# Altium schematic sheet main.SchDoc
size A3; SheetNumber: 1; SheetTotal: 3
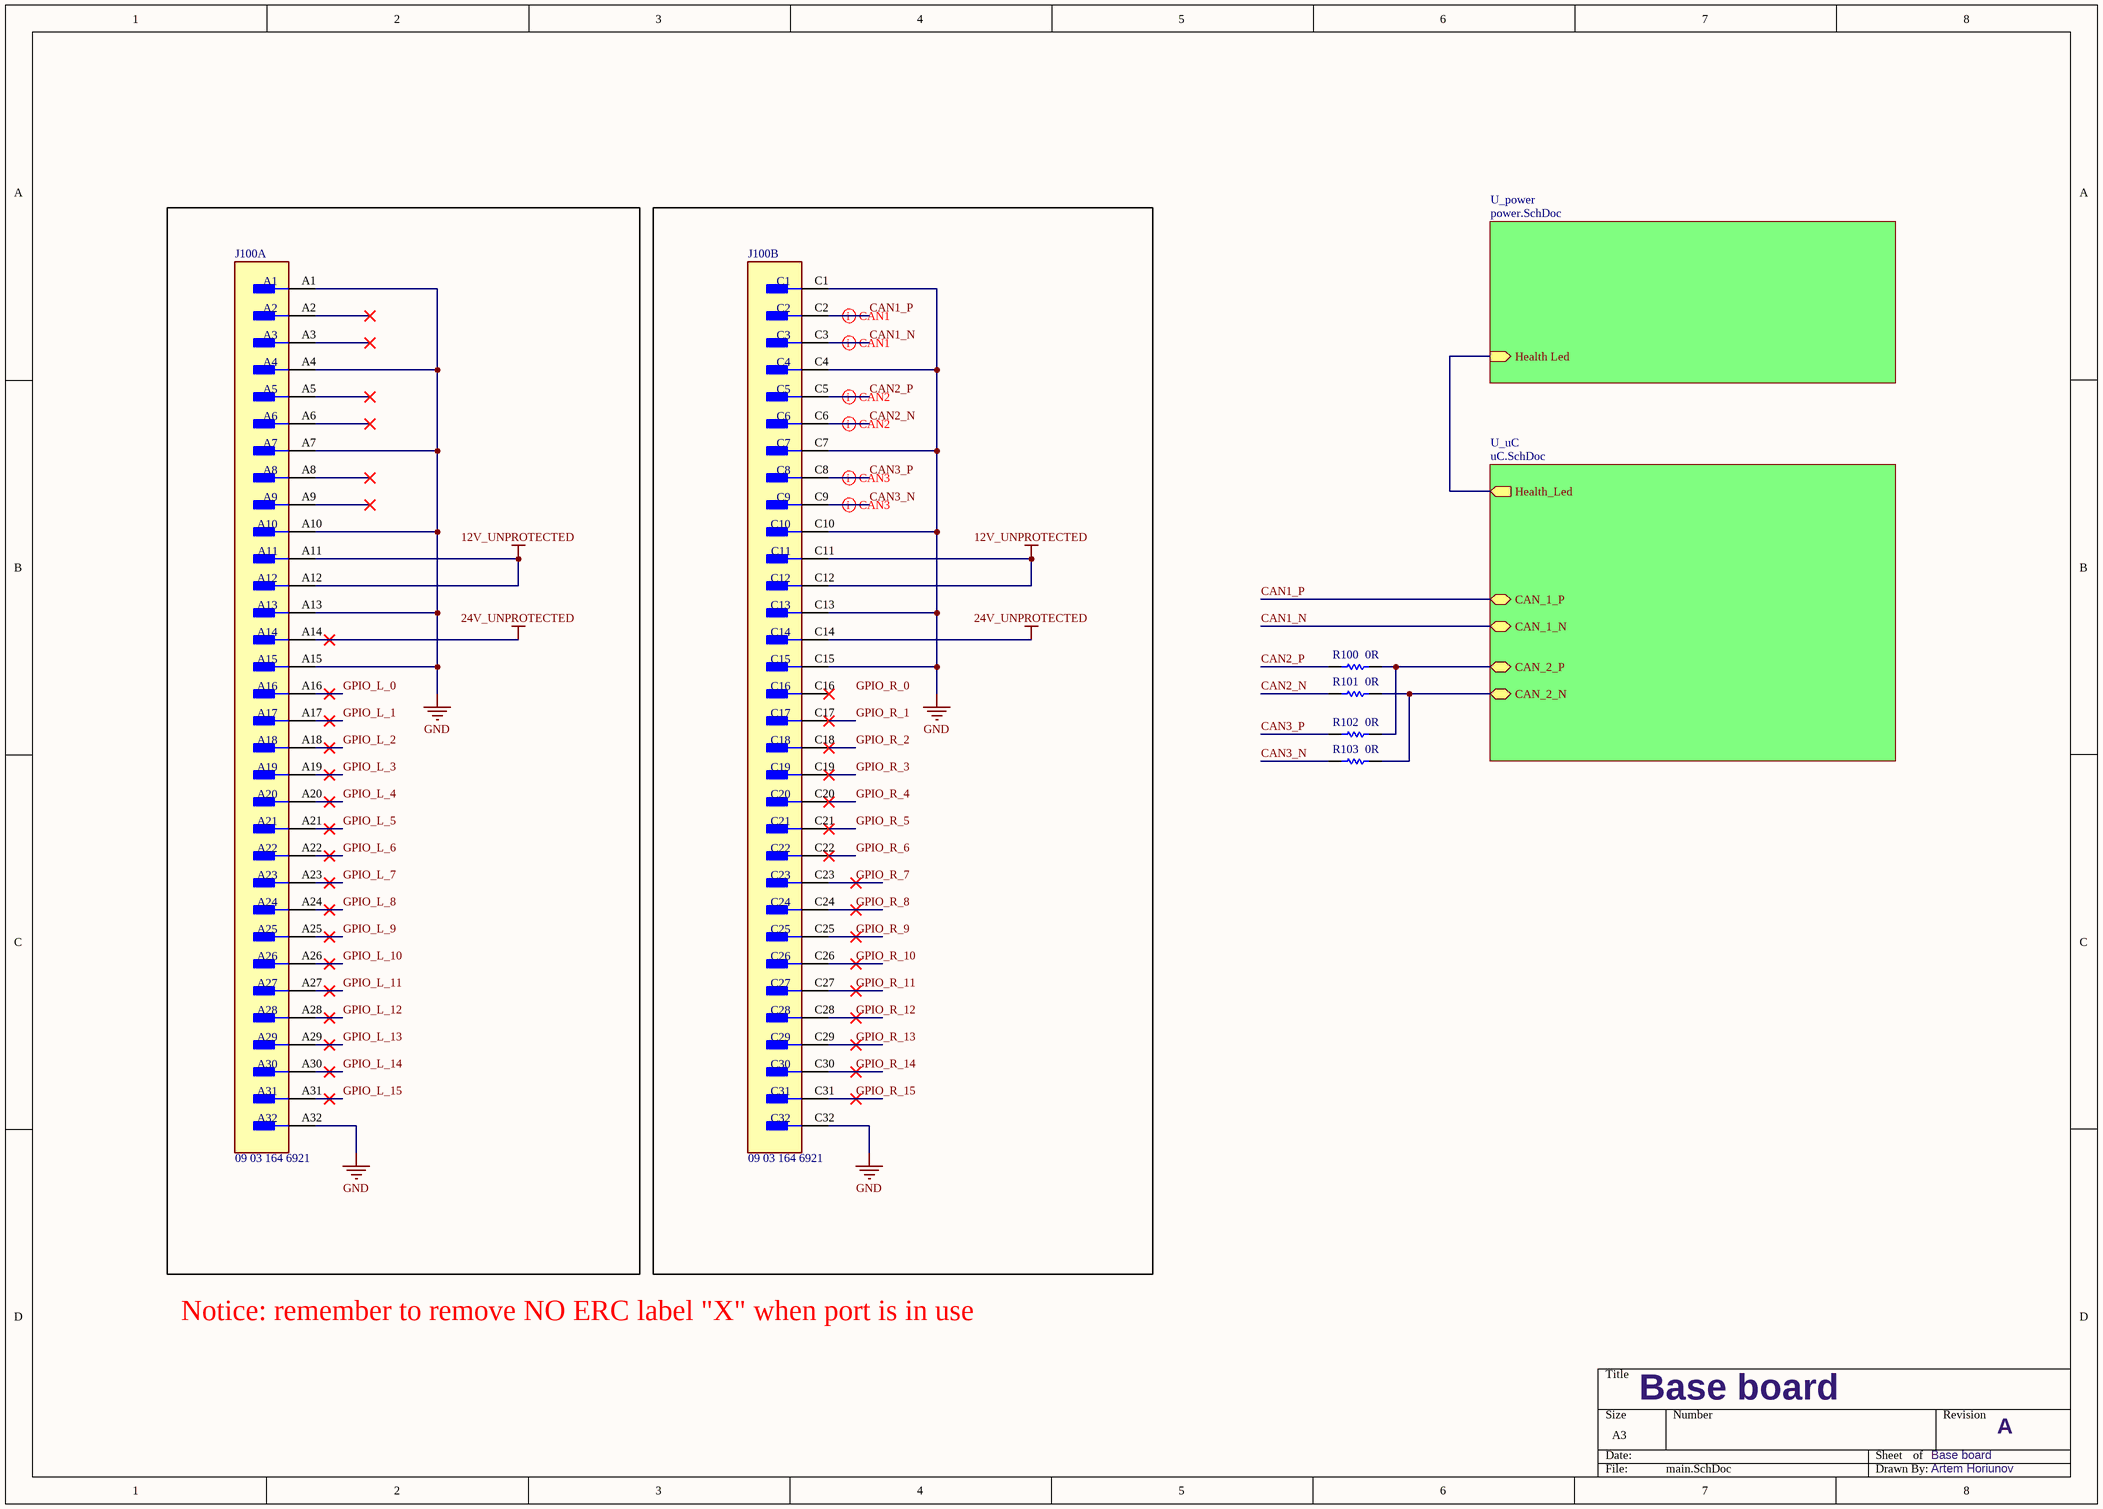
[diagram p0: main.SchDoc]

## Parts
J100  09 03 164 6921  [FP-09_03_164_6921-MFG]  (parts A,B of 2)
R100  0R  [RESC1608X55X25ML10T15]
R101  0R  [RESC1608X55X25ML10T15]
R102  0R  [RESC1608X55X25ML10T15]
R103  0R  [RESC1608X55X25ML10T15]

## Sub-sheets
U_power = power.SchDoc: Health Led (in)
U_uC = uC.SchDoc: CAN_2_P (bidir), CAN_2_N (bidir), CAN_1_P (bidir), CAN_1_N (bidir), Health_Led (out)

## Nets
12V_UNPROTECTED: J100.A11 J100.A12 J100.C11 J100.C12
24V_UNPROTECTED: J100.A14 J100.C14
GND: J100.A1 J100.A4 J100.A7 J100.A10 J100.A13 J100.A15 J100.A32 J100.C1 J100.C4 J100.C7 J100.C10 J100.C13 J100.C15 J100.C32
CAN1_N: J100.C3 ; sheet U_uC/CAN_1_N
CAN1_P: J100.C2 ; sheet U_uC/CAN_1_P
CAN2_N: J100.C6 R101.1
CAN2_P: J100.C5 R100.1
CAN3_N: J100.C9 R103.1
CAN3_P: J100.C8 R102.1
GPIO_L_0: J100.A16
GPIO_L_1: J100.A17
GPIO_L_2: J100.A18
GPIO_L_3: J100.A19
GPIO_L_4: J100.A20
GPIO_L_5: J100.A21
GPIO_L_6: J100.A22
GPIO_L_7: J100.A23
GPIO_L_8: J100.A24
GPIO_L_9: J100.A25
GPIO_L_10: J100.A26
GPIO_L_11: J100.A27
GPIO_L_12: J100.A28
GPIO_L_13: J100.A29
GPIO_L_14: J100.A30
GPIO_L_15: J100.A31
GPIO_R_1: J100.C17
GPIO_R_2: J100.C18
GPIO_R_3: J100.C19
GPIO_R_4: J100.C20
GPIO_R_5: J100.C21
GPIO_R_6: J100.C22
GPIO_R_7: J100.C23
GPIO_R_8: J100.C24
GPIO_R_9: J100.C25
GPIO_R_10: J100.C26
GPIO_R_11: J100.C27
GPIO_R_12: J100.C28
GPIO_R_13: J100.C29
GPIO_R_14: J100.C30
GPIO_R_15: J100.C31
NetR100_2: R100.2 R102.2 ; sheet U_uC/CAN_2_P
NetR101_2: R101.2 R103.2 ; sheet U_uC/CAN_2_N
(unnamed): sheet U_power/Health Led, sheet U_uC/Health_Led

Not connected (* = marked no-connect by the designer): J100 A2* A3* A5* A6* A8* A9* C16*

## Layout directives
differential pair: CAN1_N, CAN1_P, CAN2_N, CAN2_P, CAN3_N, CAN3_P

## Notes on the sheet
- Notice: remember to remove NO ERC label "X" when port is in use
- Base board
- A
- Artem Horiunov
- Labels drawn without touching a wire or pin: GPIO_R_0

## Library data of the parts
J100 = CMP-33111-000001-1: CONN DIN HDR 96POS PCB RA; Manufacturer: Harting; Pitch: 2.54mm; Number Of Contacts: 64; Current Rating: 2A; Conn Orientation: Right Angle; Conn Gender: Male; Device Class L1: Connectors; Package: 0; Number Of Rows: 2; ComponentLink2URL: https://b2b.harting.com/files/download/PRD/PDF_DS/09031200203_100580339DRW000B.pdf; Height: 11mm; Temperature Range Low: -55°C; Digikey Description: CONN DIN HDR 96POS PCB RA; Mouser Description: Conn DIN 41612 M 64 POS 2.54mm Solder RA Thru-Hole Box; Footprint Url: https://b2b.harting.com/files/download/PRD/PDF_TS/0903164X921_100072506DRW176A.pdf; Lead Free: Yes; RoHS: TRUE; Device Class L2: Backplane Connectors; Category: Conn; Manufacturer Part Number: 09 03 164 6921; Temperature Range High: +125°C; Temperature: -55°C to +125°C; ComponentLink2Description: Datasheet; Octopart: https://octopart.com/09031646921-harting+elektronik-42933; Device Class L3: unset; Automotive: No; Contact Material: Gold,Nickel
R100-R103 = CMP-2100-03667-1: Chip Resistor, 0 Ohm, +/- 5%, 0.1 W, -55 to 155 degC, 0603 (1608 Metric), RoHS, Tape and Reel; Manufacturer: Yageo; Temperature Coefficient: 200ppm/degreesC; Voltage Rating: 50V; Power Rating: 100mW; Resistance: 0mOhm; Width: 0.8mm; Max Operating Temperature: 155degC; Tolerance: 5%; Package Reference: 0603; Height: 0.45mm; Depth: 0.8mm; Package Description: 2-Pin Surface Mount Device, Body 1.6 x 0.8 mm; Termination: SMD/SMT; Package Quantity: 5000; Case/Package: 0603; Case Code (Imperial): 0603; Radiation Hardening: No; Number of Pins: 2; Length: 1.6mm; Lead Free: LeadFree; Voltage Rating (DC): 50V; Military Standard: Not; Datasheet URL: http://www.yageo.com/NewPortal/yageodocoutput?fileName=/pdf/R-Chip/PYu-RC_Group_51_RoHS_L_5.pdf; Manufacturer URL: http://www.yageo.com/; Packaging: TapeandReel; Case Code (Metric): 1608; Min Operating Temperature: -55degC; Composition: ThickFilm; RoHSCompliant: true; Contact Plating: Tin; Datasheet Version: Rev. 5, 10/2016; REACH SVHC: NoSVHC